# EAGLE design timer-v2-6 (EAGLE 6.5.0)
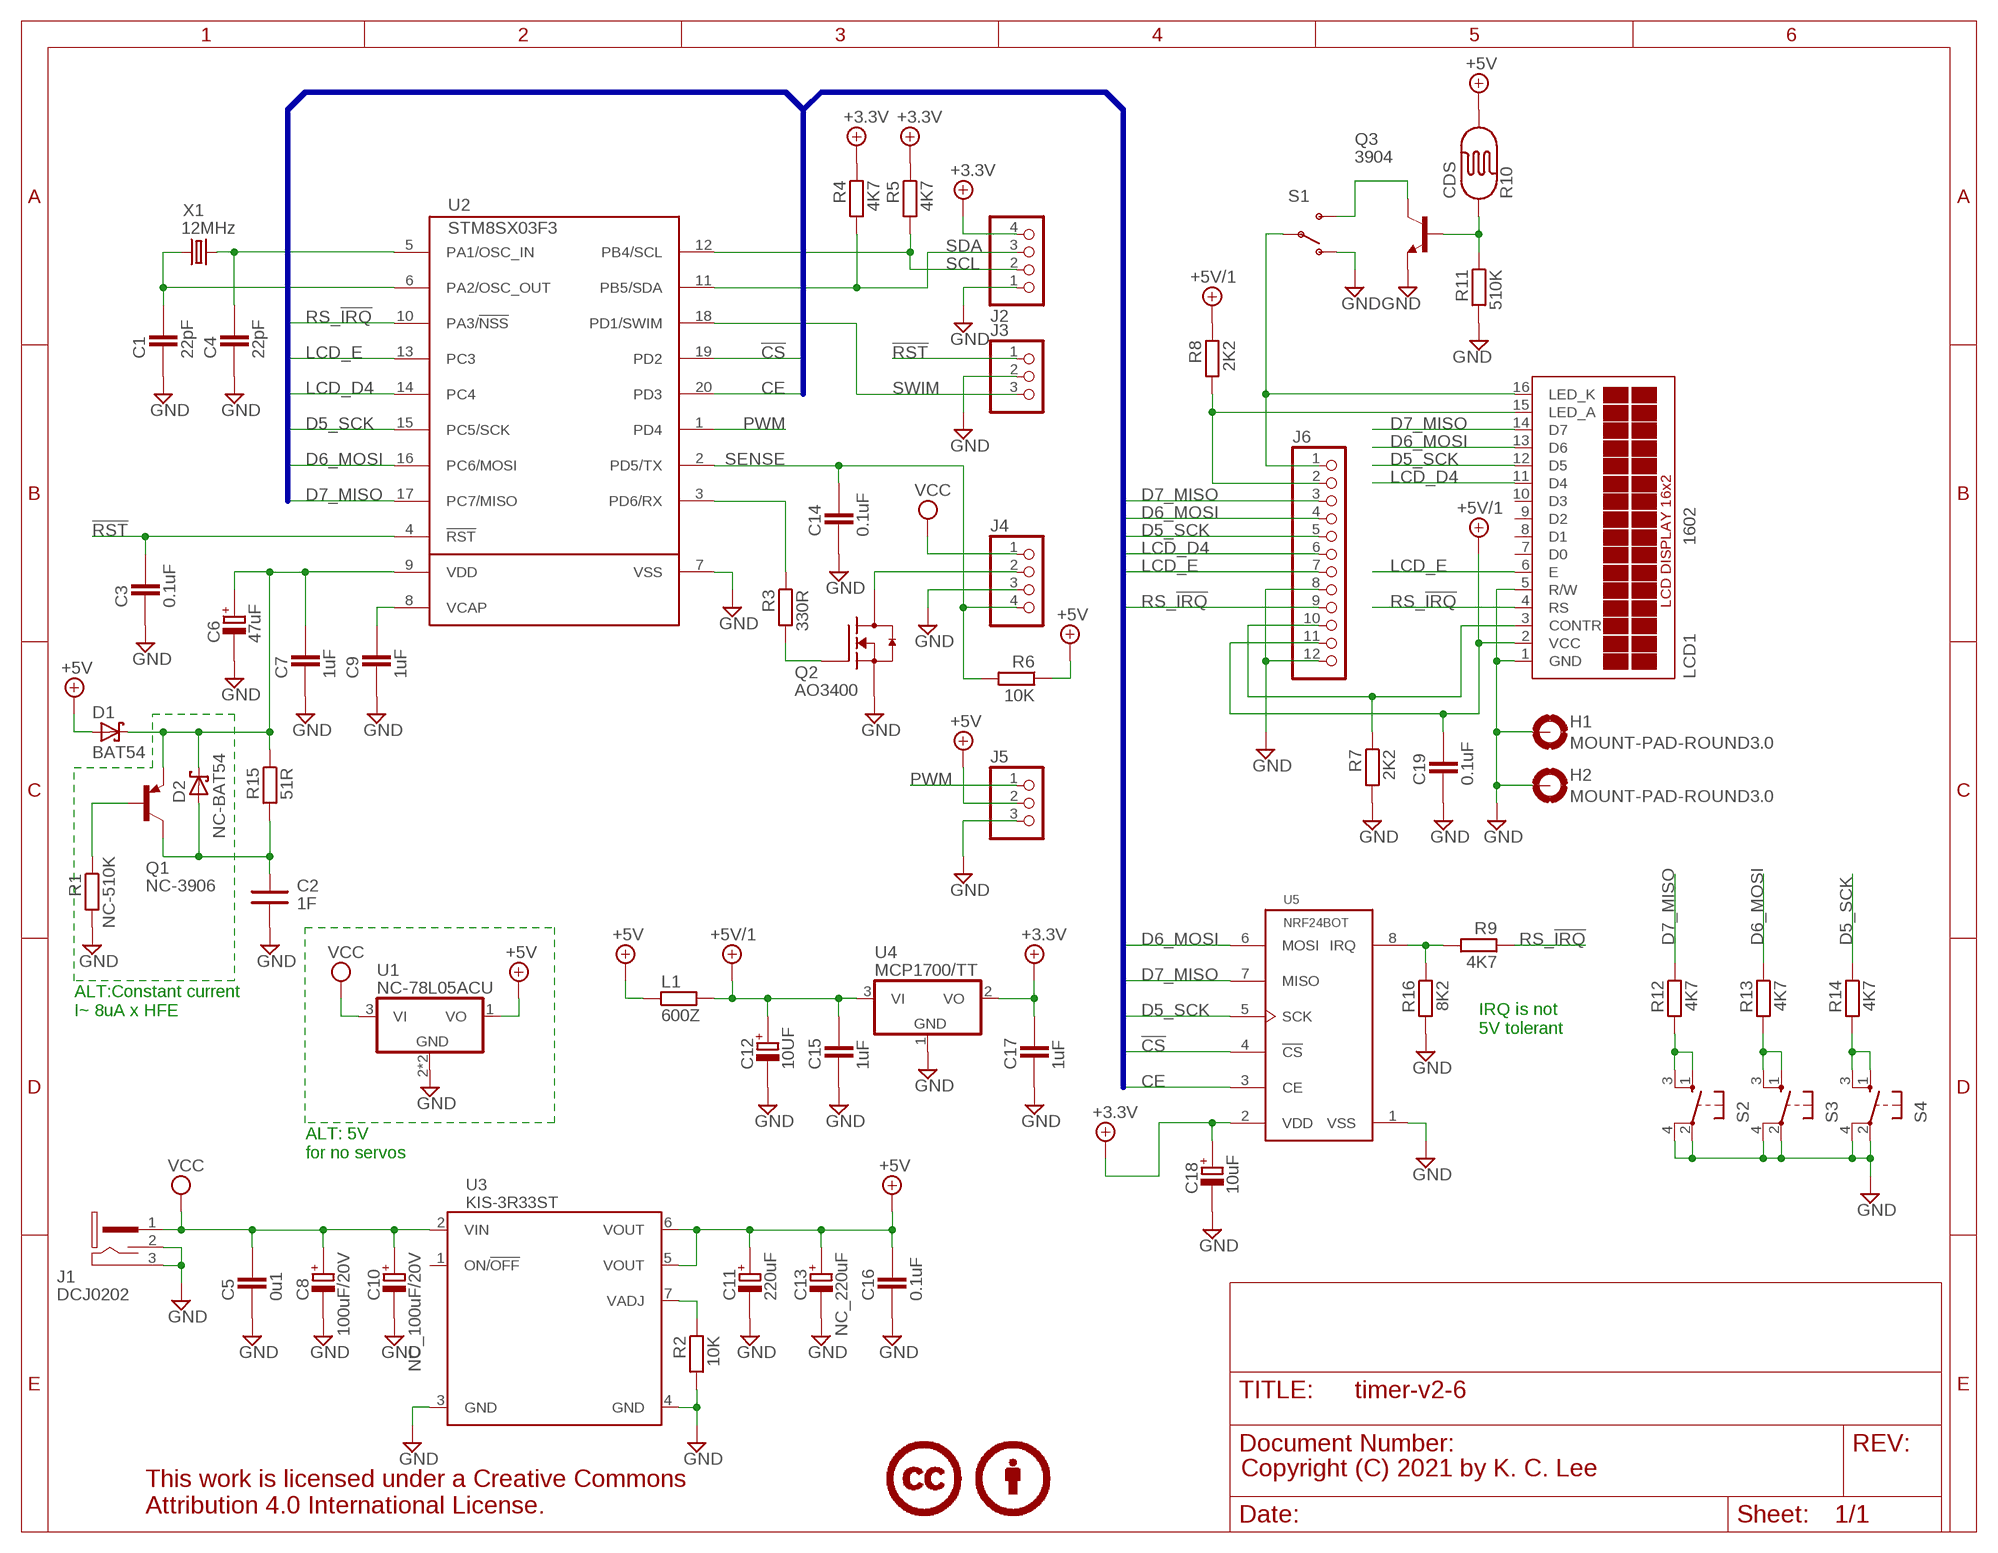
[diagram p0: schematic, sheet 1]

## Parts
C1  22pF  CAPACITOR_0603  [CAPC1608X92N]
C2  1F  GOLD_CAPCOIN-21MM-FLAT_LOW  [ELNA_DB_LOW]
C3  0.1uF  CAPACITOR_0603  [CAPC1608X92N]
C4  22pF  CAPACITOR_0603  [CAPC1608X92N]
C5  0u1  CAPACITOR_1206  [CAPC3215X168N]
C6  47uF  POLARISED_D_CASE  [CAPMP7343X310N]
C7  1uF  CAPACITOR_0603  [CAPC1608X92N]
C8  100uF/20V  POLARISED_X_CASE  [CAPMP7343X430N]
C9  1uF  CAPACITOR_0603  [CAPC1608X92N]
C10  NC_100uF/20V  POLARISED_X_CASE  [CAPMP7343X430N]
C11  220uF  POLARISED_X_CASE  [CAPMP7343X430N]
C12  10UF  POLARISED_C_CASE  [CAPMP6032X280N]
C13  NC_220uF  POLARISED_X_CASE  [CAPMP7343X430N]
C14  0.1uF  CAPACITOR_0603  [CAPC1608X92N]
C15  1uF  CAPACITOR_0603  [CAPC1608X92N]
C16  0.1uF  CAPACITOR_1206  [CAPC3215X168N]
C17  1uF  CAPACITOR_0603  [CAPC1608X92N]
C18  10uF  POLARISED_C_CASE  [CAPMP6032X280N]
C19  0.1uF  CAPACITOR_0603  [CAPC1608X92N]
D1  BAT54  SCHOTTKY_SOT-23  [SOT95P280X135-3N]
D2  NC-BAT54  SCHOTTKY_SOT-23  [SOT95P280X135-3N]
H1  MOUNT-PAD-ROUND3.0  [3,0-PAD]
H2  MOUNT-PAD-ROUND3.0  [3,0-PAD]
J1  DCJ0202  [DCJ0202-SLOTTED]
J2  PINHD-1X4_2.54-90°  [1X04/90]
J3  PINHD-1X3_2.54  [1X03]
J4  PINHD-1X4_2.54  [1X04]
J5  PINHD-1X3_2.54  [1X03]
J6  PINHD-1X12_2.54  [1X12]
L1  600Z  RESISTOR_0805  [RESC2012X70N]
LCD1  1602  TUXGR_16X2_R2NOMOUNT  [TUXGR_16X2_R2_NM]
LICENSE1  CC-BY100%  [CC-BY-100]
Q1  NC-3906  PNP_SOT-23  [SOT95P280X135-3N]
Q2  AO3400  MOSFET-NCH_SOT-23  [SOT95P280X135-3N]
Q3  3904  NPN_SOT-23  [SOT95P280X135-3N]
R1  NC-510K  RESISTOR_0603  [RESC1608X55N]
R2  10K  RESISTOR_0603  [RESC1608X55N]
R3  330R  RESISTOR_0603  [RESC1608X55N]
R4  4K7  RESISTOR_0603  [RESC1608X55N]
R5  4K7  RESISTOR_0603  [RESC1608X55N]
R6  10K  RESISTOR_0603  [RESC1608X55N]
R7  2K2  RESISTOR_0603  [RESC1608X55N]
R8  2K2  RESISTOR_0603  [RESC1608X55N]
R9  4K7  RESISTOR_0603  [RESC1608X55N]
R10  CDS  PHOTOCELLPTH  [PHOTOCELL]
R11  510K  RESISTOR_0603  [RESC1608X55N]
R12  4K7  RESISTOR_0603  [RESC1608X55N]
R13  4K7  RESISTOR_0603  [RESC1608X55N]
R14  4K7  RESISTOR_0603  [RESC1608X55N]
R15  51R  RESISTOR_0603  [RESC1608X55N]
R16  8K2  RESISTOR_0603  [RESC1608X55N]
S1  SWITCH-SPDTPTH  [SWITCH-SPDT]
S2  MOM_SWTH  [MOM_SW]
S3  MOM_SWTH  [MOM_SW]
S4  MOM_SWTH  [MOM_SW]
U1  NC-78L05ACU  78LACU  [SOT89]
U2  STM8SX03F3  [TSSOP20]
U3  KIS-3R33ST  [KIS-3R33S-THRU]
U4  MCP1700/TT  [SOT95P280X135-3N]
U5  NRF24BOT  [NRF24L01-BOT]
X1  12MHz  CRYSTALHC49U-V  [HC49U-V]

## Nets
!CS: U2.19(PD2) U5.4(!CS)
!RST: C3.2 J3.1 U2.4(!RST)
+3.3V: C17.2 C18.+ J2.4 R4.1 R5.1 U4.2(VO) U5.2(VDD)
+5V: C11.+ C13.+ C16.2 D1.1(A) J5.2 L1.1 R6.1 R10.2 U1.1(VO) U3.5(VOUT) U3.6(VOUT)
+5V/1: C12.+ C15.2 C19.2 J6.11 L1.2 LCD1.2(VCC) R8.1 U4.3(VI)
CE: U2.20(PD3) U5.3(CE)
D5_SCK: J6.5 LCD1.12(D5) R14.1 U2.15(PC5/SCK) U5.5(SCK)
D6_MOSI: J6.4 LCD1.13(D6) R13.1 U2.16(PC6/MOSI) U5.6(MOSI)
D7_MISO: J6.3 LCD1.14(D7) R12.1 U2.17(PC7/MISO) U5.7(MISO)
GND: C1.1 C2.- C3.1 C4.1 C5.1 C6.- C7.1 C8.- C9.1 C10.- C11.- C12.- C13.- C14.1 C15.1 C16.1 C17.1 C18.- C19.1 H1.B3,0(MOUNT) H2.B3,0(MOUNT) J1.2 J1.3 J2.1 J3.2 J4.3 J5.3 J6.8 J6.12 LCD1.1(GND) LCD1.5(R/W) Q2.2(S) Q3.2(E) R1.2 R2.2 R7.2 R11.2 R16.2 S1.1(O) S2.2 S2.4 S3.2 S3.4 S4.2 S4.4 U1.2(GND) U1.4(GND) U2.7(VSS) U3.3(GND) U3.4(GND) U4.1(GND) U5.1(VSS)
LCD_A: J6.2 LCD1.15(LED_A) R8.2
LCD_D4: J6.6 LCD1.11(D4) U2.14(PC4)
LCD_E: J6.7 LCD1.6(E) U2.13(PC3)
N$1: J4.2 Q2.3(D)
N$2: C9.2 U2.8(VCAP)
N$3: R2.1 U3.7(VADJ)
N$4: C4.2 U2.5(PA1/OSC_IN) X1.2
N$5: C1.2 U2.6(PA2/OSC_OUT) X1.1
N$6: J6.1 LCD1.16(LED_K) S1.2(P)
N$7: C6.+ C7.2 D1.3(K) D2.3(K) Q1.2(E) R15.1 U2.9(VDD)
N$8: C2.+ D2.1(A) Q1.3(C) R15.2
N$9: R14.2 S4.1 S4.3
N$11: Q1.1(B) R1.1
N$12: Q3.1(B) R10.1 R11.1
N$16: Q2.1(G) R3.2
N$17: R3.1 U2.3(PD6/RX)
N$18: R13.2 S3.1 S3.3
N$19: R12.2 S2.1 S2.3
N$20: R9.2 R16.1 U5.8(IRQ)
N$21: Q3.3(C) S1.3(S)
N$27: J6.10 LCD1.3(CONTR) R7.1
PWM: J5.1 U2.1(PD4)
RS_!IRQ: J6.9 LCD1.4(RS) R9.1 U2.10(PA3/!NSS)
SCL: J2.2 R5.2 U2.12(PB4/SCL)
SDA: J2.3 R4.2 U2.11(PB5/SDA)
SENSE: C14.2 J4.4 R6.2 U2.2(PD5/TX)
SWIM: J3.3 U2.18(PD1/SWIM)
VCC: C5.2 C8.+ C10.+ J1.1 J4.1 U1.3(VI) U3.2(VIN)
Unconnected: LCD1.7(D0) LCD1.8(D1) LCD1.9(D2) LCD1.10(D3) U3.1(ON/!OFF)

## Buses
B$1

## Notes on the sheet
- ALT:Constant current
  I~ 8uA x HFE
- IRQ is not 
  5V tolerant
- ALT: 5V 
  for no servos
- Copyright (C) 2021 by K. C. Lee

## Library data of the parts
C1 C3-C5 C7 C9 C14-C17 C19 = ipc-7351-capacitor:CAPACITOR_
C2 = Misc Passives:GOLD_CAP
C6 C8 C10-C13 C18 = ipc-7351-capacitor:POLARISED_
D1 D2 = ipc-7351-diode:SCHOTTKY_
H1 H2 = holes:MOUNT-PAD-ROUND: MOUNTING PAD, round
J1 = Misc Conn:DCJ0202: DC POWER JACK Source: DCJ0202.pdf Pin = CUI Inc. PJ-102A with formed pins
J2 J4 = pinhead-1:PINHD-1X4: PIN HEADER
J3 J5 = pinhead-1:PINHD-1X3: PIN HEADER
J6 = pinhead-1:PINHD-1X12: PIN HEADER
L1 R1-R9 R11-R16 = ipc-7351-resistor:RESISTOR_
LCD1 = Misc opto:TUXGR_16X2_R2: Tuxgraphics LCD display 16x2 characters reflective, without background light Source: tuxgr_12x2_r2.pdf; OC_FARNELL: unknown; OC_NEWARK: unknown
LICENSE1 = Misc logo:CC-BY
Q1 = ipc-7351-transistor:PNP_
Q2 = ipc-7351-transistor:MOSFET-NCH_
Q3 = ipc-7351-transistor:NPN_
R10 = SparkFun-Sensors:PHOTOCELL: CdS photoresistor. This is a low cost way to detect light levels. Resistance decreases with more incoming light. SparkFun SKU: SEN-09088
S1 = SparkFun-Electromechanical:SWITCH-SPDT: SPDT Switch Simple slide switch, Spark Fun Electronics SKU : COM-00102 DPDT SMT slide switch, AYZ0202, SWCH-08179
S2-S4 = Misc Passives:MOM_SW: Tact Switch
U1 = Misc Power:78L*: Positive VOLTAGE REGULATOR Source: http://cache.national.com/ds/LM/LM78L05.pdf http://www.fairchildsemi.com/ds/LM/LM7805.pdf
U2 = Misc Processor:STM8SX03F
U3 = Misc Power:KIS-3R33S: M2307 Adjustable Sync Buck Power Supply Module
U4 = Misc Power:MCP1700
U5 = misc pcb:NRF24
X1 = crystal:CRYSTAL: CRYSTAL; OC_FARNELL: 1666969; OC_NEWARK: unknown

## Board
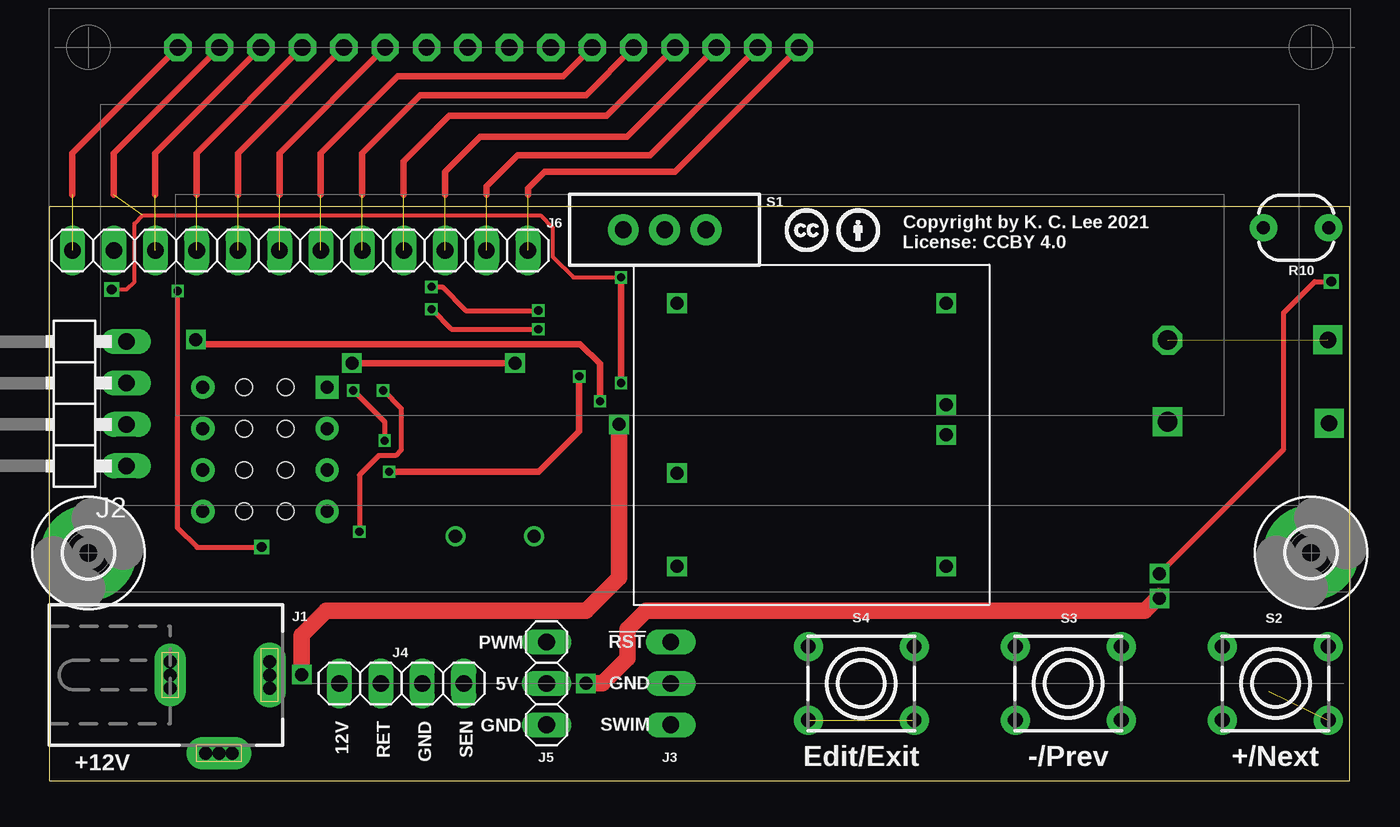
[diagram p1: board, top side]
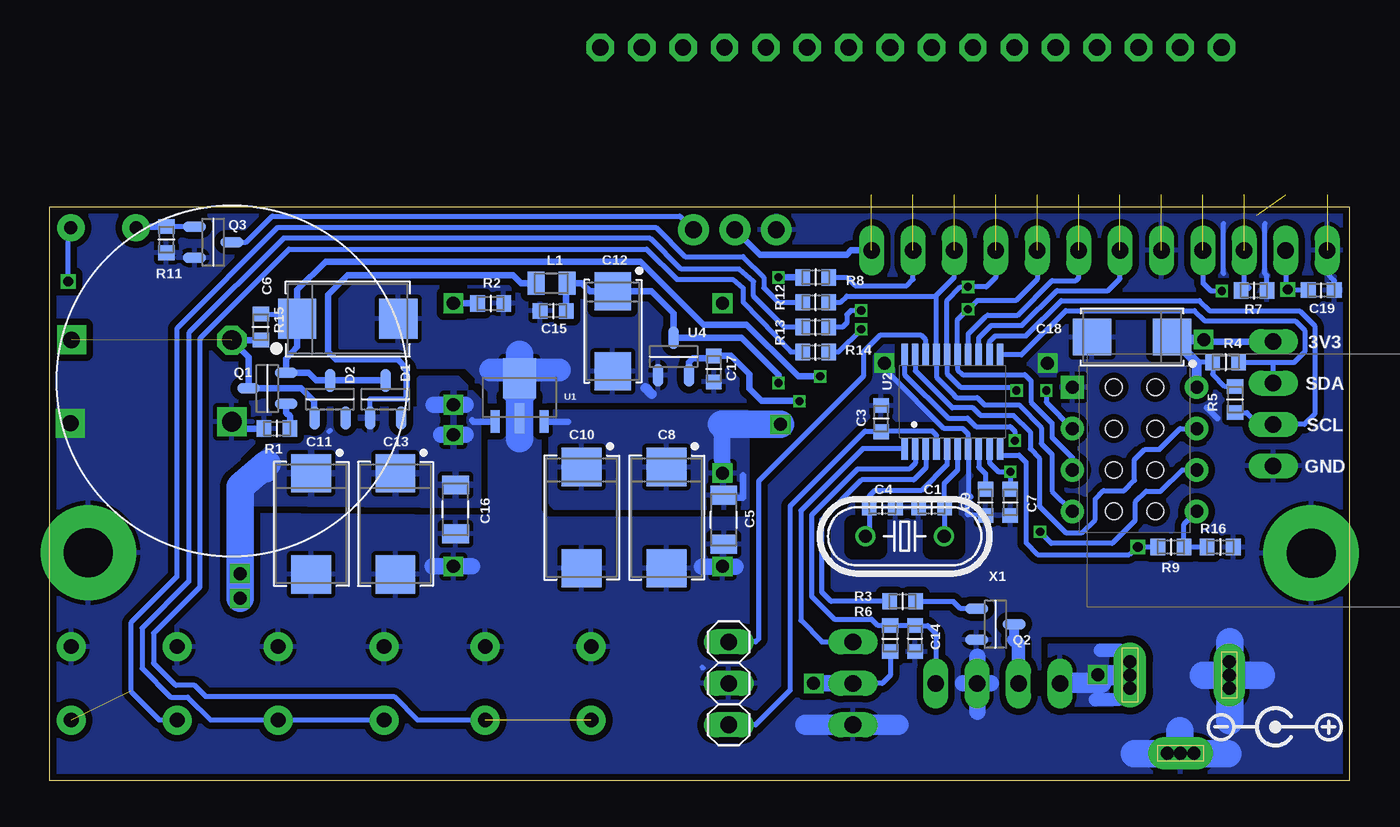
[diagram p2: board, bottom side, seen from below]

Size 79.76 x 35.18 mm. Coordinates in mm from the lower left corner, seen from the top.
Outline: 0,0 79.76,0 79.76,35.18 0,35.18 0,0
Copper layers (1*16): Top 0.035559375mm / dielectric 1.6mm / Bottom 0.035559375mm
Design rules "oshpark-2layer-tented-vias": minimum track width 6mil, minimum drill 10mil, track to track 6mil, track to pad 6mil, pad to pad 6mil, via to via 6mil, smd to smd 6mil, copper to edge 15mil, drill to drill 6mil, minimum pad ring 5mil, minimum via ring 5mil, stop-mask expansion 2.5mil, vias tented up to drill 13mil, thermal gap 10mil
bRestrict: 7 lines

### Footprints (pad centres in the part's own frame; a part is rotated, then mirrored left to right if it is on the bottom)
CAPC1608X92N = smd 0.9 x 0.95: 1 -0.8,0; 2 0.8,0
ELNA_DB_LOW = drill 1.2 octagon: + 2.5,0 | drill 1.2 square: - -2.5,0
CAPC3215X168N = smd 1.15 x 1.65: 1 -1.5,0; 2 1.5,0
CAPMP7343X310N = smd 2.35 x 2.45: + -3.1,0; - 3.1,0
CAPMP7343X430N = smd 2.35 x 2.45: + -3.1,0; - 3.1,0
CAPMP6032X280N = smd 2.35 x 2.25: + -2.45,0; - 2.45,0
SOT95P280X135-3N = smd 1.4 x 0.65: 1 -1.15,0.95; 2 -1.15,-0.95; 3 1.15,0
3,0-PAD = drill 3 pad 5.842: B3,0 0,0
DCJ0202-SLOTTED = drill 0.8 pad 2 long: 1 0,3.1; 2 4.8,0 | drill 0.8: 1A -0.813,3.1; 1B 0.813,3.1; 2A 4.8,-0.813; 2B 4.8,0.813; 3A -0.813,-3; 3B 0.813,-3 | drill 0.8 pad 1.93 long: 3 0,-3
1X04/90 = drill 1.016 long: 1 -3.81,-3.81; 2 -1.27,-3.81; 3 1.27,-3.81; 4 3.81,-3.81
1X03 = drill 1.016 long: 1 -2.54,0; 2 0,0; 3 2.54,0
1X04 = drill 1.016 long: 1 -3.81,0; 2 -1.27,0; 3 1.27,0; 4 3.81,0
1X12 = drill 1.016 long: 1 -13.97,0; 2 -11.43,0; 3 -8.89,0; 4 -6.35,0; 5 -3.81,0; 6 -1.27,0; 7 1.27,0; 8 3.81,0; 9 6.35,0; 10 8.89,0; 11 11.43,0; 12 13.97,0
RESC2012X70N = smd 1.05 x 1.4: 1 -0.95,0; 2 0.95,0
TUXGR_16X2_R2_NM = drill 1 pad 1.676 octagon: 1 -32,15.5; 2 -29.46,15.5; 3 -26.92,15.5; 4 -24.38,15.5; 5 -21.84,15.5; 6 -19.3,15.5; 7 -16.76,15.5; 8 -14.22,15.5; 9 -11.68,15.5; 10 -9.14,15.5; 11 -6.6,15.5; 12 -4.06,15.5; 13 -1.52,15.5; 14 1.02,15.5; 15 3.56,15.5; 16 6.1,15.5
RESC1608X55N = smd 0.9 x 1: 1 -0.8,0; 2 0.8,0
PHOTOCELL = drill 0.8 pad 1.676: 1 -2,0; 2 2,0
SWITCH-SPDT = drill 1.016 pad 1.88: 1 0,2.54; 2 0,0; 3 0,-2.54
MOM_SW = drill 0.9 pad 1.778: 1 -2.25,3.25; 2 2.25,3.25; 3 -2.25,-3.25; 4 2.25,-3.25
SOT89 = smd 0.57 x 1.4: 1 -1.5,-1.475; 3 1.5,-1.475 | smd 0.65 x 1.8: 2 0,-1.275 | smd 2 x 2.45: 4 0,1.175
TSSOP20 = smd 0.4 x 1.35: 1 -2.925,-2.875; 2 -2.275,-2.875; 3 -1.625,-2.875; 4 -0.975,-2.875; 5 -0.325,-2.875; 6 0.325,-2.875; 7 0.975,-2.875; 8 1.625,-2.875; 9 2.275,-2.875; 10 2.925,-2.875; 11 2.925,2.875; 12 2.275,2.875; 13 1.625,2.875; 14 0.975,2.875; 15 0.325,2.875; 16 -0.325,2.875; 17 -0.975,2.875; 18 -1.625,2.875; 19 -2.275,2.875; 20 -2.925,2.875
KIS-3R33S-THRU = drill 0.8 square: 1 -8.255,8.065; 2 -8.255,-2.349; 3 -8.255,-8.065; 4 8.255,-8.065; 5 8.255,0; 6 8.255,1.841; 7 8.255,8.065
NRF24L01-BOT = drill 0.8 pad 1.422 square: 1 2.54,0 | drill 0.8 pad 1.422: 2 -5.08,0; 3 2.54,2.54; 4 -5.08,2.54; 5 2.54,5.08; 6 -5.08,5.08; 7 2.54,7.62; 8 -5.08,7.62 | hole 1: -2.54,7.62; -2.54,5.08; -2.54,2.54; -2.54,0; 0,0; 0,2.54; 0,5.08; 0,7.62
HC49U-V = drill 0.813: 1 -2.413,0; 2 2.413,0

### Placement (x,y rotation side)
C1  25.65,16.76 0 bottom
C2  68.58,24.51 90 bottom
C3  28.75,22.2 270 bottom
C4  28.68,16.76 180 bottom
C5  38.4,16 90 bottom
C6  61.47,28.32 0 bottom
C7  20.83,17.07 90 bottom
C8  41.91,16.13 270 bottom
C9  22.35,17.07 90 bottom
C10  47.12,16.13 270 bottom
C11  63.7,15.75 270 bottom
C12  45.21,27.56 270 bottom
C13  58.55,15.75 270 bottom
C14  26.67,8.71 90 bottom
C15  48.87,28.8 0 bottom
C16  54.86,16.64 90 bottom
C17  39.01,25.25 90 bottom
C18  13.36,27.2 180 bottom
C19  1.75,30.07 180 bottom
D1  59.16,23.39 90 bottom
D2  62.56,23.39 90 bottom
H1  2.37,13.96 0 top
H2  77.38,13.98 0 top
J1  10.39,6.48 270 top
J2  0.89,23.11 90 top
J3  38.1,5.97 90 bottom
J4  21.59,5.97 0 top
J5  30.48,5.97 270 top
J6  15.37,32.51 180 top
L1  48.97,30.51 0 bottom
LCD1  39.88,29.46 0 top  (outside the outline)
LICENSE1  45.09,32.38 0 top
Q1  66.4,24.05 180 bottom
Q2  21.74,9.6 0 bottom
Q3  69.72,33.02 0 bottom
R1  65.81,21.59 180 bottom
R2  52.7,29.26 0 bottom
R3  27.43,11 0 bottom
R4  7.62,25.65 0 bottom
R5  7.04,23.37 270 bottom
R6  28.19,8.71 90 bottom
R7  5.88,30.05 0 bottom
R8  32.77,30.86 0 bottom
R9  10.97,14.33 0 bottom
R10  76.45,33.91 0 top
R11  72.59,33.17 270 bottom
R12  32.77,29.34 180 bottom
R13  32.77,27.81 180 bottom
R14  32.77,26.29 180 bottom
R15  66.8,27.81 270 bottom
R16  7.95,14.33 0 bottom
S1  37.72,33.78 90 top
S2  75.18,5.97 90 top
S3  62.48,5.97 90 top
S4  49.78,5.97 90 top
U1  50.93,23.5 0 bottom
U2  24.38,23.24 0 bottom
U3  46.74,21.21 0 top
U4  41.48,26.01 90 bottom
U5  14.48,24.13 180 bottom
U$1  [POLARITY]  4.57,3.3 0 bottom
X1  27.3,14.99 180 bottom

### Tracks (layer width: path | path; a pad name or v marks a point on that pad's centre or on a via)
!CS
  Bottom 0.305: U2.19 26.66,25.14 24.38,22.86 23.11,22.86 22.66,22.4 20.62,22.4 19.61,21.39 19.61,20.34 19.05,19.79 19.05,16.84 17.42,15.21 16.43,15.21 15.62,16 15.62,17.27 15.11,17.78 13.84,17.78 13.21,18.41 13.21,19.68 12.57,20.32 11.68,20.32 10.41,21.59 U5.4
!RST
  Bottom 0.305: U2.4 25.36,21.17 25.6,21.44 28.71,21.44 C3.2 28.79,21.44 29.74,21.44 34.34,16.84 34.34,5.54 36.45,3.43 J3.1
+3.3V  (via drill 0.5, 0.8)
  Top 0.406: v33.76,23.27 33.76,25.55 32.54,26.77 9.25,26.77 v8.97,27.05
  Bottom 0.305: 9.66,25.89 9.42,25.65 R4.1 8.42,24.93 7.66,24.17 R5.1
  Bottom 0.406: v33.76,23.27 33.93,23.29 36.09,23.29 36.83,24.03 36.83,24.92 37.96,26.05 C17.2 39.03,25.91 40.28,25.91 40.53,25.66 U4.2 | J2.4 8.59,26.92 v8.97,27.05
  Bottom 0.61: v8.97,27.05 10.54,27.05 10.67,27.18 10.66,27.18 C18.+ 10.54,26.83 10.54,26.77 9.66,25.89 9.4,25.63 U5.2
+5V  (via drill 0.6, 0.8)
  Top 0.305: v78.61,30.61 77.6,30.61 75.69,28.7 75.69,20.32 v68.07,12.7
  Top 1.016: v32.89,5.97 33.91,5.97 35.43,7.49 35.43,9.27 36.58,10.41 67.18,10.41 68.07,11.3 v68.07,11.18
  Bottom 0.305: R6.1 28.19,6.45 28.68,5.97 J5.2 | v78.61,30.61 78.61,33.75 R10.2 | 62.53,21.46 62.64,21.41 | D1.1 60.12,22.25 60.12,23.39 57.86,23.39
  Bottom 0.406: U1.1 53.77,22.02 53.85,22.1 | L1.1 50.85,30.5 51.33,30.99 61.47,30.99 62.66,29.79 62.66,26.29 62.2,25.83 58.42,25.83 57.86,25.27 57.86,23.39
  Bottom 1.016: 55.75,21.21 54.23,21.21 | 56.21,23.04 54.23,23.04 | J5.2 v32.89,5.97 | 66.93,19.3 66.42,18.8 | 63.76,18.8 C11.+
  Bottom 1.27: 63.5,19.18 C11.+
  Bottom 1.676: v68.07,11.18 v68.07,12.7 68.07,18.03 66.42,19.43
  pour Bottom (isolate 0.406): 53.47,16.89 53.47,23.37 54.74,24.64 57.02,24.64 57.02,22.73 64.01,22.73 67.44,19.3 67.44,17.02
+5V/1  (via drill 0.5, 0.6)  (1 unrouted)
  Top 0.254: v3.81,30.12 4.72,30.12 5.21,30.61 5.21,34.16 5.71,34.67 30.1,34.67 30.86,33.91 30.86,32.13 32.13,30.86 v35.05,30.86
  Top 0.406: v35.05,24.38 v35.05,30.86 | LCD1.2 3.94,38.48 3.94,35.94
  Bottom 0.305: C19.2 3.63,30.07 v3.81,30.12 3.81,30.1 3.94,30.23 J6.11
  Bottom 0.406: C15.2 48.07,30.2 L1.2 47.12,30.5 46.62,30.01 C12.+ 42.84,30.01 41.48,28.65 U4.3 37.32,27.16 35.05,24.89 v35.05,24.38 | v35.05,30.86 R8.1
CE  (via drill 0.5)
  Top 0.305: v18.62,23.93 20.55,22 v20.55,20.85
  Bottom 0.305: U2.20 27.31,24.9 24.64,22.23 23.44,22.23 22.94,21.72 20.83,21.72 20.55,21.44 v20.55,20.85 | v18.62,23.93 18.62,23.22 U5.3
D5_SCK  (via drill 0.5)  (1 unrouted)
  Top 0.305: v23.42,28.91 24.64,27.69 v29.97,27.69
  Top 0.406: LCD1.12 32.89,42.04 22.73,42.04 19.18,38.48 19.18,35.94
  Bottom 0.305: J6.5 19.18,30.76 20.5,29.44 22.86,29.44 23.39,28.91 v23.42,28.91 24.06,28.27 U2.15 24.06,25.2 23.75,24.89 19.94,24.89 19.56,24.51 19.56,23.22 18.26,21.92 18.26,21.06 17.02,19.81 U5.5 | R14.1 31.37,26.29 v29.97,27.69
D6_MOSI  (via drill 0.5)  (1 unrouted)
  Top 0.305: v20.45,23.93 21.57,22.81 21.57,20.3 21.21,19.94 20.19,19.94 19,18.75 v19,15.27 | v23.42,30.28 24.08,30.28 25.53,28.83 v29.97,28.83
  Top 0.406: LCD1.13 34.16,40.77 24.51,40.77 21.72,37.97 21.72,35.94
  Bottom 0.305: v20.45,23.93 20.65,24.13 23.88,24.13 24.71,24.96 U2.16 24.71,29.44 23.88,30.28 v23.42,30.28 22.3,30.28 21.72,30.86 J6.4 | U5.6 10.29,19.05 11.58,17.75 12.5,17.75 13.18,17.07 13.18,15.95 14.58,14.55 18.31,14.55 v19,15.27 | v29.97,28.83 30.61,28.83 30.86,28.57 30.86,28.07 31.11,27.81 R13.1
D7_MISO  (1 unrouted)
  Top 0.406: LCD1.14 35.43,39.5 26.42,39.5 24.26,37.34 24.26,35.94
  Bottom 0.305: 25.36,29.76 U2.17 25.36,24.75 24.28,23.67 24.28,23.65 24.13,23.5 22.86,23.5 22.4,23.04 20.3,23.04 18.92,21.64 18.92,20.68 18.26,20.02 18.26,17.75 U5.7 | 25.36,29.76 24.26,30.86 J6.3 | R12.1 31.24,29.34 30.86,29.72 25.4,29.72 25.36,29.76
GND  (via drill 0.8, 1 pad 1.78)  (2 unrouted)
  Top 0.406: LCD1.1 1.4,38.48 1.4,35.94 | LCD1.5 11.56,38.48 11.56,35.94 | v18.54,25.6 v28.55,25.6
  Bottom 0.305: 23.24,17.4 23.41,17.57 U2.7 23.41,21.25 23.75,21.59 24.89,21.59 28.22,24.92 | C9.1 23.46,16.29 23.47,16.84 | 5.21,34.16 5.21,31.11 5.21,31.09 5.08,30.99 R7.2 | 39.73,6.96 39.67,6.91 | 7.75,31.11 7.75,34.16 | C19.1 0.95,30.67 1.4,31.11 J6.12
  Bottom 0.406: R1.2 68.16,21.59 C2.- | 8.76,22.86 8.13,22.23
  Bottom 0.61: 42.82,23.7 43.2,24.08
  Bottom 1.016: 53.85,13.16 56.26,13.16 | 37.69,13.13 39.73,13.13 | 23.72,5.97 22.02,5.97 | 22.86,7.59 22.86,4.24
  Bottom 1.27: 27.69,3.43 33.4,3.43
  Bottom 1.422: 48.49,25.17 52.68,25.17
  Bottom 1.676: 7.37,8.51 7.37,3.68 | 7.49,1.65 13.21,1.65 | 10.41,3.05 10.41,1.52 | 5.44,6.45 8.99,6.45 | 50.93,26.14 50.93,20.98
  other vias: 78.49,21.92
  pour Bottom (isolate 0.406, rank 6): 0,0 79.63,0 79.38,35.18 0,35.18
  pour Bottom (isolate 0.305, rank 6): 7.62,20.7 17.65,20.57 17.65,25.4 7.62,25.53
LCD_A  (1 unrouted)
  Top 0.406: LCD1.15 36.83,38.35 28.7,38.35 26.8,36.45 26.8,35.94
  Bottom 0.305: R8.2 30.86,30.86 30.35,30.35 27.18,30.35 26.8,30.73 J6.2
LCD_D4  (1 unrouted)
  Top 0.406: LCD1.11 31.49,43.18 21.34,43.18 16.64,38.48 16.64,35.94
  Bottom 0.305: U2.14 23.41,27.39 22.35,28.45 22.23,28.55 20.37,28.55 18.26,30.66 16.82,30.66 16.64,30.84 J6.6
LCD_E  (1 unrouted)
  Top 0.406: LCD1.6 14.1,38.48 14.1,35.94
  Bottom 0.305: U2.13 22.76,27.15 22,27.91 20.12,27.91 17.96,30.05 14.83,30.05 14.1,30.79 J6.7
N$1
  Bottom 0.61: Q2.3 20.59,8.65
  Bottom 0.813: 20.59,8.65 20.32,8.38 J4.2
N$2
  Bottom 0.305: U2.8 22.76,19.23 22.35,18.82 C9.2
N$3
  Bottom 0.406: R2.1 55,29.26 U3.7
N$4
  Bottom 0.305: U2.5 24.71,19.36 26.29,17.78 29.16,17.78 29.48,17.46 C4.2 29.48,15.23 X1.2
N$5
  Bottom 0.305: X1.1 24.85,15.56 C1.2 24.89,16.8 24.89,18.21 24.06,19.05 U2.6
N$6  (1 unrouted)
  Top 0.406: LCD1.16 38.35,37.34 30.35,37.34 29.34,36.32 29.34,35.94
  Bottom 0.406: J6.1 30.61,32.51 30.86,32.26 36.2,32.26 S1.2
N$7  (via drill 0.5)
  Top 0.406: v20.83,18.95 30,18.95 32.49,21.44 v32.49,24.79
  Bottom 0.305: U2.9 22.11,19.49 21.57,18.95 v20.83,18.95 C7.2 20.83,17.86 | R15.1 64.57,28.61 C6.+
  Bottom 0.406: v32.49,24.79 33.81,24.79 34.16,25.15 37.01,27.96 39.65,27.96 43.51,31.83 62.84,31.83 64.57,30.1 C6.+ 64.57,26.59 65.25,25.88 Q1.2 63.87,25 63.41,24.54 D2.3 D1.3
N$8  (via drill 1 pad 1.78)  (1 unrouted)
  Bottom 0.406: D2.1 63.53,23.26 64.34,24.05 Q1.3 67.55,25.98 C2.+ R15.2
  other vias: 78.41,27.03
N$9  (1 unrouted)
  Bottom 0.305: R14.2 34.29,26.29 37.21,29.34 37.21,30.23 37.85,30.73 41.27,30.73 43.13,32.59 65.08,32.59 70.54,27.13 70.54,11.89 73.38,9.04 73.38,7.21 72.01,5.84 70.87,5.84 70.19,5.17 58.64,5.17 57.19,3.72 S4.3
N$11
  Bottom 0.406: Q1.1 65.25,22.57 65.01,22.34 R1.1
N$12
  Bottom 0.305: Q3.1 R11.1
  Bottom 0.406: R11.1 74.39,33.97 R10.1
N$16
  Bottom 0.305: Q2.1 23.89,10.55 24.33,11 R3.2
N$17
  Bottom 0.305: U2.3 26.01,19.18 26.75,18.44 29.95,18.44 32.38,16 32.38,11.56 31.83,11 R3.1
N$18
  Bottom 0.305: R13.2 34.67,27.81 36.58,29.72 36.58,30.61 37.47,31.37 41.02,31.37 42.88,33.22 42.9,33.22 42.95,33.27 65.41,33.27 71.22,27.46 71.22,12.22 74.09,9.35 74.09,6.88 72.34,5.13 71.27,5.13 69.86,3.72 S3.3 S3.1
N$19  (1 unrouted)
  Bottom 0.305: R12.2 35.05,29.34 35.94,30.23 35.94,30.86 37.21,32.13 40.77,32.13 42.57,33.93 65.76,33.93 71.93,27.74 71.93,12.52 74.78,9.68 74.78,5.49 73.01,3.72 S2.1
N$20
  Bottom 0.305: R16.1 R9.2 10.17,15.73 U5.8
N$21
  Bottom 0.305: Q3.3 67.69,33.02 66.09,34.62 41.1,34.62 S1.3
N$27  (1 unrouted)
  Top 0.406: LCD1.3 6.48,38.48 6.48,35.94
  Bottom 0.305: J6.10 6.5,30.53 6.17,30.2 R7.1
PWM
  Bottom 0.305: U2.1 29.88,20.37 33.68,16.56 33.68,9.83 32.38,8.51 J5.1
RS_!IRQ  (via drill 0.5, 0.6)  (1 unrouted)
  Top 0.305: v7.85,30.02 7.85,15.49 9.04,14.3 12.22,14.3 v13.01,14.33
  Top 0.406: LCD1.4 9.02,38.48 9.02,35.94
  Bottom 0.305: U2.10 21.46,20.09 21.46,19.96 20.3,19.96 19.86,19.53 19.86,14.58 19.15,13.87 13.54,13.87 13.08,14.33 v13.01,14.33 R9.1 | v7.85,30.02 8.51,30.02 9.02,30.53 J6.9
SCL
  Bottom 0.305: U2.12 22.11,26.91 21.74,27.28 19.86,27.28 17.7,29.44 9.22,29.44 8.59,28.8 3.07,28.8 2.16,27.89 2.16,22.48 2.79,21.84 J2.2 5.59,21.84 6.31,22.57 R5.2
SDA
  Bottom 0.305: 21.45,25.98 U2.11 20.14,26.12 17.42,28.83 9.53,28.83 8.89,28.19 3.35,28.19 2.77,27.61 2.77,26.29 3.43,25.63 4.7,25.63 | 4.7,25.63 6.93,25.63 6.96,25.65 R4.2 6.81,25.64 | J2.3 4.7,25.63
SENSE
  Bottom 0.305: U2.2 26.66,19.47 27.03,19.1 30.2,19.1 33.02,16.28 33.02,11.3 31.62,9.91 29.34,9.91 28.94,9.51 R6.2 C14.2 25.89,9.51 25.4,9.02 J4.4
SWIM
  Bottom 0.305: U2.18 26.01,27.02 26.29,27.3 28.83,27.3 29.84,26.29 29.84,24.79 36.27,18.36 36.27,8.69 36.45,8.51 J3.3
VCC  (via drill 0.8)
  Top 1.016: v15.47,6.5 15.47,8.91 16.97,10.41 32.89,10.41 34.92,12.45 v34.92,21.84
  Bottom 0.406: U1.3 47.96,22.02 | 38.63,17.35 37.21,17.35 37.21,18.74
  Bottom 0.813: 15.32,8 14.1,8 13.84,7.75 13.36,7.26 | 13.49,5.66 13.51,5.66 14.2,4.98 15.62,4.95
  Bottom 1.016: 38.54,21.84 U3.2 | 17.75,5.99 J4.1
  Bottom 1.27: 17.75,5.99 15.24,5.99 15.47,6.22 v15.47,6.5 | 15.22,6.48 J1.1
  Bottom 1.676: v34.92,21.84 38.54,21.84
  pour Bottom: 49.02,22.61 49.02,17.02 48.77,16.76 36.96,16.76 36.96,22.61
  pour Bottom: 18.41,8.26 18.41,4.7 13.21,4.7 13.21,8.26

### Text on the board
tPlace: Copyright by K. C. Lee 2021 / License: CCBY 4.0 | PWM | !RST | 5V | GND | 12V | RET | GND | SEN | GND | SWIM | +12V | Edit/Exit | -/Prev | +/Next
bPlace: 3V3 | SDA | SCL | GND